# EasyEDA Pro project #第八届立创电赛#基于瑞萨单片机的电池内阻测试仪.eprj

# Schematic #第八届立创电赛#基于瑞萨单片机的电池内阻测试仪
Create Date: 2023-05-11; Page Name: #第八届立创电赛#基于瑞萨单片机的电池内阻测试仪; Project Name: #第八届立创电赛#基于瑞萨单片机的电池内阻测试仪; Schematic Name: #第八届立创电赛#基于瑞萨单片机的电池内阻测试仪; Update Date: 2023-09-26; Company: 嘉立创EDA; Page Size: A2; Version: V1.0
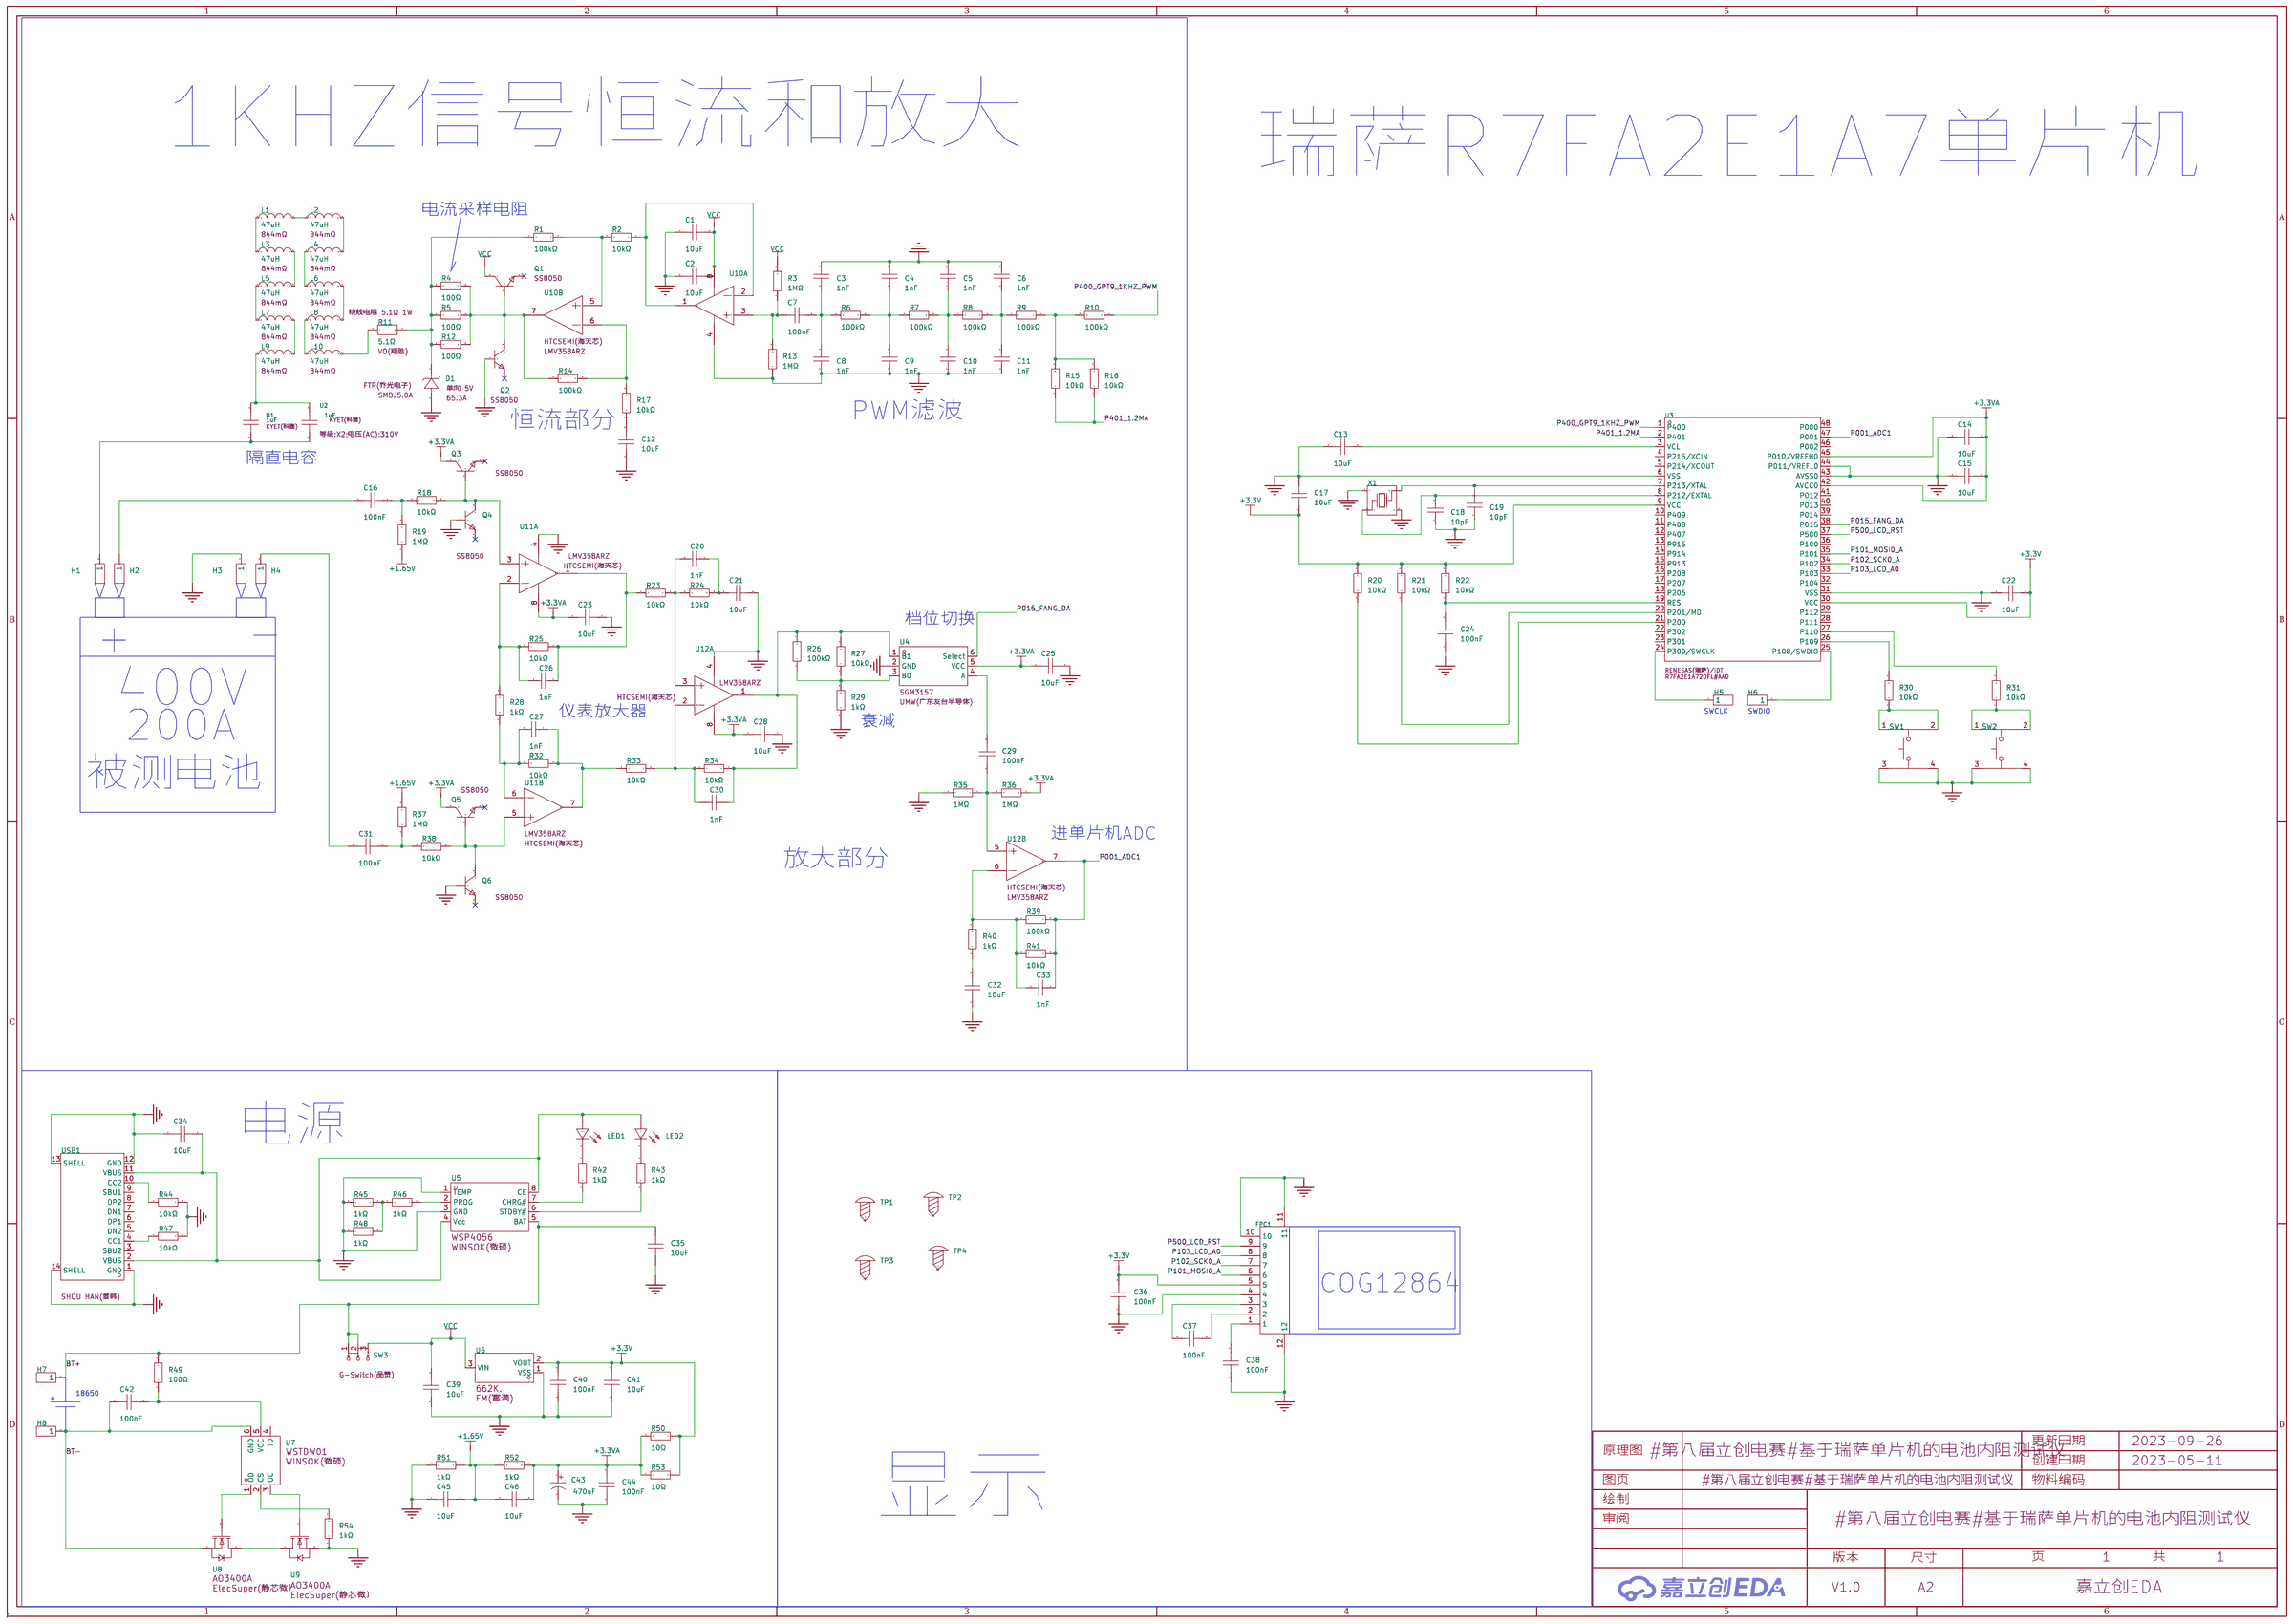
[diagram p0: schematic sheet]

## Parts
C1  10uF  [C0603]
C2  10uF  [C0603]
C3  1nF  [C0603]
C4  1nF  [C0603]
C5  1nF  [C0603]
C6  1nF  [C0603]
C7  100nF  [C0603]
C8  1nF  [C0603]
C9  1nF  [C0603]
C10  1nF  [C0603]
C11  1nF  [C0603]
C12  10uF  [C0603]
C13  10uF  [C0603]
C14  10uF  [C0603]
C15  10uF  [C0603]
C16  100nF  [CAP-TH_L13.0-W6.0-P10.00-D1.0]
C17  10uF  [C0603]
C18  10pF  [C0603]
C19  10pF  [C0603]
C20  1nF  [C0603]
C21  10uF  [C0603]
C22  10uF  [C0603]
C23  10uF  [C0603]
C24  100nF  [C0603]
C25  10uF  [C0603]
C26  1nF  [C0603]
C27  1nF  [C0603]
C28  10uF  [C0603]
C29  100nF  [C0603]
C30  1nF  [C0603]
C31  100nF  [CAP-TH_L13.0-W6.0-P10.00-D1.0]
C32  10uF  [C0603]
C33  1nF  [C0603]
C34  10uF  [C0603]
C35  10uF  [C0603]
C36  100nF  [C0603]
C37  100nF  [C0603]
C38  100nF  [C0603]
C39  10uF  [C0603]
C40  100nF  [C0603]
C41  10uF  [C0603]
C42  100nF  [C0603]
C43  470uF  [CAP-TH_BD8.0-P3.50-D0.6-FD]
C44  100nF  [C0603]
C45  10uF  [C0603]
C46  10uF  [C0603]
D1  SMBJ5.0A  [SMB_L4.3-W3.6-LS5.3-RD]
FPC1  AFA01-S10FCA-00  [FPC-SMD_10P-P1.0_FGS-XJ-H2.0]
H1  -  [HDR-TH_1P-V-M_XKB_X4611WV-01I-C28D40]
H2  -  [HDR-TH_1P-V-M_XKB_X4611WV-01I-C28D40]
H3  -  [HDR-TH_1P-V-M_XKB_X4611WV-01I-C28D40]
H4  -  [HDR-TH_1P-V-M_XKB_X4611WV-01I-C28D40]
H5  -  [HDR-TH_1P-V-M_XKB_X4611WV-01I-C28D40]
H6  -  [HDR-TH_1P-V-M_XKB_X4611WV-01I-C28D40]
H7  -  [HDR-TH_1P-V-M_XKB_X4611WV-01I-C28D40]
H8  -  [HDR-TH_1P-V-M_XKB_X4611WV-01I-C28D40]
L1  47uH  [IND-SMD_L4.5-W4.0_SLF0403]
L2  47uH  [IND-SMD_L4.5-W4.0_SLF0403]
L3  47uH  [IND-SMD_L4.5-W4.0_SLF0403]
L4  47uH  [IND-SMD_L4.5-W4.0_SLF0403]
L5  47uH  [IND-SMD_L4.5-W4.0_SLF0403]
L6  47uH  [IND-SMD_L4.5-W4.0_SLF0403]
L7  47uH  [IND-SMD_L4.5-W4.0_SLF0403]
L8  47uH  [IND-SMD_L4.5-W4.0_SLF0403]
L9  47uH  [IND-SMD_L4.5-W4.0_SLF0403]
L10  47uH  [IND-SMD_L4.5-W4.0_SLF0403]
LED1  204-10SURD/S530-A3-L  [LED-TH_BD3.0-P2.54-FD]
LED2  204-10SURD/S530-A3-L  [LED-TH_BD3.0-P2.54-FD]
Q1  SS8050  [SOT-23-3_L2.9-W1.3-P1.90-LS2.4-BR]
Q2  SS8050  [SOT-23-3_L2.9-W1.3-P1.90-LS2.4-BR]
Q3  SS8050  [SOT-23-3_L2.9-W1.3-P1.90-LS2.4-BR]
Q4  SS8050  [SOT-23-3_L2.9-W1.3-P1.90-LS2.4-BR]
Q5  SS8050  [SOT-23-3_L2.9-W1.3-P1.90-LS2.4-BR]
Q6  SS8050  [SOT-23-3_L2.9-W1.3-P1.90-LS2.4-BR]
R1  100kΩ  [R0603]
R2  10kΩ  [R0603]
R3  1MΩ  [R0603]
R4  100Ω  [R2512]
R5  100Ω  [R2512]
R6  100kΩ  [R0603]
R7  100kΩ  [R0603]
R8  100kΩ  [R0603]
R9  100kΩ  [R0603]
R10  100kΩ  [R0603]
R11  5.1Ω  [RES-TH_BD3.5-L9.0-P13.00-D0.8]
R12  100Ω  [R2512]
R13  1MΩ  [R0603]
R14  100kΩ  [R0603]
R15  10kΩ  [R0603]
R16  10kΩ  [R0603]
R17  10kΩ  [R0603]
R18  10kΩ  [R0603]
R19  1MΩ  [R0603]
R20  10kΩ  [R0603]
R21  10kΩ  [R0603]
R22  10kΩ  [R0603]
R23  10kΩ  [R0603]
R24  10kΩ  [R0603]
R25  10kΩ  [R0603]
R26  100kΩ  [R0603]
R27  10kΩ  [R0603]
R28  1kΩ  [R0603]
R29  1kΩ  [R0603]
R30  10kΩ  [R0603]
R31  10kΩ  [R0603]
R32  10kΩ  [R0603]
R33  10kΩ  [R0603]
R34  10kΩ  [R0603]
R35  1MΩ  [R0603]
R36  1MΩ  [R0603]
R37  1MΩ  [R0603]
R38  10kΩ  [R0603]
R39  100kΩ  [R0603]
R40  1kΩ  [R0603]
R41  10kΩ  [R0603]
R42  1kΩ  [R0603]
R43  1kΩ  [R0603]
R44  10kΩ  [R0603]
R45  1kΩ  [R0603]
R46  1kΩ  [R0603]
R47  10kΩ  [R0603]
R48  1kΩ  [R0603]
R49  100Ω  [R0603]
R50  10Ω  [R0603]
R51  1kΩ  [R0603]
R52  1kΩ  [R0603]
R53  10Ω  [R0603]
R54  1kΩ  [R0603]
SW1  1TS005A-2500-5001  [SW-TH_4P-L6.0-W6.0-P3.90-LS6.5]
SW2  1TS005A-2500-5001  [SW-TH_4P-L6.0-W6.0-P3.90-LS6.5]
SW3  SS-12F20-G070  [SW-TH_G-SWITCH_SS-12F20-G070]
TP1  -  [M2螺丝]
TP2  -  [M2螺丝]
TP3  -  [M2螺丝]
TP4  -  [M2螺丝]
U1  1uF  [CAP-TH_L18.0-W11.0-P15.00-D0.8]
U2  1uF  [CAP-TH_L18.0-W11.0-P15.00-D0.8]
U3  R7FA2E1A72DFL#AA0  [LQFP-48_L7.0-W7.0-P0.50-LS9.0-BL]
U4  SGM3157  [SC-70-6_L2.2-W1.3-P0.65-LS2.1-BL]
U5  WSP4056  [SOP-8_L5.1-W3.9-P1.27-LS6.0-BL]
U6  662K.  [SOT-23-3_L2.9-W1.3-P1.90-LS2.4-BR]
U7  WSTDW01  [SOT-23-6_L2.9-W1.6-P0.95-LS2.8-BR]
U8  AO3400A  [SOT-23-3_L3.0-W1.6-P1.90-LS2.8-BR]
U9  AO3400A  [SOT-23-3_L3.0-W1.6-P1.90-LS2.8-BR]
U10  LMV358ARZ  [SOP-8_L4.9-W3.9-P1.27-LS6.0-BL]  (sections 1,2)
U11  LMV358ARZ  [SOP-8_L4.9-W3.9-P1.27-LS6.0-BL]  (sections 1,2)
U12  LMV358ARZ  [SOP-8_L4.9-W3.9-P1.27-LS6.0-BL]  (sections 1,2)
USB1  TYPE-C 16PIN 2MD(073)  [USB-C-SMD_TYPE-C-6PIN-2MD-073]
X1  -  [OSC-SMD_4P-L3.2-W2.5-BL]

## Library data of the parts
C1 C2 C12-C15 C17 C21-C23 C25 C28 C32 C34 C35 C39 C41 C45 C46 = CL10A106KP8NNNC: 容值:10uF;精度:±10%;额定电压:10V;材质(温度系数):X5R;; LCSC Part Name: 10uF ±10% 10V; Supplier Part: C19702; Manufacturer: SAMSUNG(三星); Supplier Footprint: 0603; JLCPCB Part Class: Basic Part; Datasheet: https://atta.szlcsc.com/upload/public/pdf/source/20160103/1457707703378.pdf; Supplier: LCSC; Tolerance: ±10%; Voltage Rated: 10V; Temperature Coefficient: X5R
C3-C6 C8-C11 C20 C26 C27 C30 C33 = CC0603JRNPO9BN102: 容值:1nF;精度:±5%;额定电压:50V;材质(温度系数):NP0;; LCSC Part Name: 1nF ±5% 50V; Supplier Part: C106246; Manufacturer: YAGEO(国巨); Supplier Footprint: 0603; JLCPCB Part Class: Extended Part; Datasheet: https://atta.szlcsc.com/upload/public/pdf/source/20170505/1493957838062.pdf; Supplier: LCSC; Tolerance: ±5%; Voltage Rated: 50V; Temperature Coefficient: NP0
C7 C24 C29 C36-C38 C40 C42 C44 = CC0603KRX7R9BB104: 容值:100nF;精度:±10%;额定电压:50V;材质(温度系数):X7R;; LCSC Part Name: 100nF ±10% 50V; Supplier Part: C14663; Manufacturer: YAGEO(国巨); Supplier Footprint: 0603; JLCPCB Part Class: Basic Part; Datasheet: https://atta.szlcsc.com/upload/public/pdf/source/20180910/C282072_33301C7F631E79921B82A8DAC6BCC5B3.pdf; Supplier: LCSC; Tolerance: ±10%; Voltage Rated: 50V; Temperature Coefficient: X7R
C16 C31 = MP2104K27C3X6LC: 等级:X2;容值:100nF;精度:±10%;; LCSC Part Name: 等级:X2 100nF ±10%; Supplier Part: C105759; Manufacturer: SRD(圣融达); Supplier Footprint: 插件,P=10mm; JLCPCB Part Class: Extended Part; Datasheet: https://atta.szlcsc.com/upload/public/pdf/source/20211112/28AD7BCA5F9A6D19E46F5213448E69C0.pdf; Supplier: LCSC; Subclass: X2; Tolerance: ±10%
C18 C19 = CC0603JRNPO9BN100: 容值:10pF;精度:±5%;额定电压:50V;材质(温度系数):NP0;; LCSC Part Name: 10pF ±5% 50V; Supplier Part: C106245; Manufacturer: YAGEO(国巨); Supplier Footprint: 0603; JLCPCB Part Class: Extended Part; Datasheet: https://atta.szlcsc.com/upload/public/pdf/source/20170505/1493957837406.pdf; Supplier: LCSC; Tolerance: ±5%; Voltage Rated: 50V; Temperature Coefficient: NP0
C43 = KM477M016F12RR0VH2FP0: 容值:470uF;精度:±20%;额定电压:16V;; LCSC Part Name: 470uF ±20% 16V; Supplier Part: C28067; Manufacturer: CX(承兴); Supplier Footprint: 插件,D8xL12mm; JLCPCB Part Class: Extended Part; Datasheet: https://atta.szlcsc.com/upload/public/pdf/source/20211027/06D6BA3719C264B639DC286D935D03EA.pdf; Supplier: LCSC; Tolerance: ±20%; Rated Voltage: 16V; φD: 8mm; L: 12mm; Lead Spacing: 3.5mm; Lifetime @ Temp: 2000hrs@105℃
D1 = SMBJ5.0A_C693503: 极性:单向;反向截止电压(Vrwm):5V;击穿电压(最小值):6.4V;峰值脉冲电流(Ipp)@10/1000s:65.3A;最大钳位电压:9.2V;; LCSC Part Name: 单向 5V; Supplier Part: C693503; Manufacturer: FTR(乔光电子); Supplier Footprint: SMB(DO-214AA); JLCPCB Part Class: Extended Part; Datasheet: https://atta.szlcsc.com/upload/public/pdf/source/20200701/C693490_2A1922FF33BB98835C22E740F3EF18EC.pdf; Supplier: LCSC; Polarity: 单向; Reverse Stand-Off Voltage (Vrwm): 5V; Breakdown Voltage (Min): 6.4V; Peak Pulse Current (Ipp)@10/1000μs: 65.3A; Maximum Clamping Voltage: 9.2V
FPC1 = AFA01-S10FCA-00: 间距:1mm;触点数量:10;锁定特性:翻盖式;安装类型:卧贴;触点类型:下接;; LCSC Part Name: FPC 1.0MM 10P 翻盖式 H2.0mm 下接; Supplier Part: C262756; Manufacturer: JS(钜硕电子); Supplier Footprint: P=1mm; JLCPCB Part Class: Extended Part; Supplier: LCSC; Pitch: 1mm; Number of Contacts: 10; Locking Feature: 翻盖式; Mounting Type: 卧贴; Contact Type: 下接; Height Above Board: 2mm; FFC, FCB Thickness: 0.3mm~0.3mm
H1-H8 = HDR-M_2.54_1x1P: Supplier Part: C81276; Supplier Footprint: 插件; JLCPCB Part Class: Extended Part
L1-L10 = SLF0403-470KTT: 电感值:47uH;精度:±10%;额定电流:540mA;; LCSC Part Name: 47uH ±10% 540mA 844mΩ; Supplier Part: C182152; Manufacturer: Sunltech(韩国顺磁); Supplier Footprint: SMD; JLCPCB Part Class: Extended Part; Datasheet: https://atta.szlcsc.com/upload/public/pdf/source/20180622/C182152_7E479EAE8C34B9E34441182146F93730.pdf; Supplier: LCSC; Tolerance: ±10%; Rated Current: 540mA; DC Resistance (DCR): 844mΩ
LED1 LED2 = 204-10SURD/S530-A3-L: 发光颜色:红灯;二极管配置:-;主波长:624nm;色温:-;功率:60mW;安装方式:-;; LCSC Part Name: 红灯; Supplier Part: C99771; Manufacturer: EVERLIGHT(亿光); Supplier Footprint: 插件,D=3mm; JLCPCB Part Class: Extended Part; Datasheet: https://atta.szlcsc.com/upload/public/pdf/source/20170504/1493866972127.pdf; Supplier: LCSC; Emitted Color: 红灯; Lens Color: 雾状红; Dominant Wavelength: 624nm; Peak Wavelength: 632nm; Forward Current: 20mA; Power Dissipation: 60mW; Viewing Angle: 40°; Operating Temperature: -40℃~+85℃; Lamp Holder Type: 3mm圆形灯头
Q1-Q6 = SS8050_C5249676: Polarity NPN 耗散功率(W) 0.3 最大集电极电流(mA) 1500 集电极-基极电压（V） 40 饱和压降（V） 0.5 集电极/基极电流（mA） 800/80 最大工作频率(MHz) 100; Supplier Part: C5249676; Manufacturer: ElecSuper(静芯微）; Supplier Footprint: SOT-23; JLCPCB Part Class: Extended Part; Datasheet: https://atta.szlcsc.com/upload/public/pdf/source/20221109/25143ABAE3EF3AA2633DA047E92DED74.pdf; Supplier: LCSC
R1 R6-R10 R14 R26 R39 = RC0603FR-07100KL: 电阻类型:厚膜电阻;阻值:100kΩ;精度:±1%;功率:100mW;; LCSC Part Name: 100kΩ ±1% 100mW; Supplier Part: C14675; Manufacturer: YAGEO(国巨); Supplier Footprint: 0603; JLCPCB Part Class: Extended Part; Datasheet: https://atta.szlcsc.com/upload/public/pdf/source/20140324/1457707028752.pdf; Supplier: LCSC; Type: 厚膜电阻; Tolerance: ±1%; Power(Watts): 100mW; Temperature Coefficient: ±100ppm/℃; Overload Voltage (Max): 75V; Operating Temperature Range: -55℃~+155℃
R2 R15-R18 R20-R25 R27 R30-R34 R38 R41 R44 R47 = RC0603FR-0710KL: 电阻类型:厚膜电阻;阻值:10kΩ;精度:±1%;功率:100mW;; LCSC Part Name: 10kΩ ±1% 100mW; Supplier Part: C98220; Manufacturer: YAGEO(国巨); Supplier Footprint: 0603; JLCPCB Part Class: Extended Part; Datasheet: https://atta.szlcsc.com/upload/public/pdf/source/20170522/1495423494387.pdf; Supplier: LCSC; Type: 厚膜电阻; Tolerance: ±1%; Power(Watts): 100mW; Temperature Coefficient: ±100ppm/℃; Overload Voltage (Max): 75V; Operating Temperature Range: -55℃~+155℃
R3 R13 R19 R35-R37 = 0603WAF1004T5E: 电阻类型:厚膜电阻;阻值:1MΩ;精度:±1%;功率:100mW;; LCSC Part Name: 1MΩ ±1% 100mW; Supplier Part: C22935; Manufacturer: UNI-ROYAL(厚声); Supplier Footprint: 0603; JLCPCB Part Class: Basic Part; Datasheet: https://atta.szlcsc.com/upload/public/pdf/source/20200306/C422600_1E6D84923E4A46A82E41ADD87F860B5C.pdf; Supplier: LCSC; Type: 厚膜电阻; Tolerance: ±1%; Power(Watts): 100mW; Temperature Coefficient: ±100ppm/℃; Overload Voltage (Max): 75V; Operating Temperature Range: -55℃~+155℃
R4 R5 R12 = CRH2512J100RE04Z: 电阻类型:厚膜电阻;阻值:100Ω;精度:±5%;功率:2W;; LCSC Part Name: 100Ω ±5% 2W; Supplier Part: C175441; Manufacturer: EVER OHMS(天二科技); Supplier Footprint: 2512; JLCPCB Part Class: Extended Part; Datasheet: https://atta.szlcsc.com/upload/public/pdf/source/20190415/C175441_84808E9EE7421A14EC56ED3F852BAD33.pdf; Supplier: LCSC; Type: 厚膜电阻; Tolerance: ±5%; Power(Watts): 2W; Temperature Coefficient: ±100ppm/℃; Overload Voltage (Max): 200V; Operating Temperature Range: -55℃~+155℃
R11 = KNP1WS-5Ω1±5%-2T52: 电阻类型:绕线电阻;阻值:5.1Ω;精度:±5%;功率:1W;温度系数:±350ppm/℃;; LCSC Part Name: 绕线电阻 5.1Ω 1W; Supplier Part: C601740; Manufacturer: VO(翔胜); Supplier Footprint: 插件; JLCPCB Part Class: Extended Part; Datasheet: https://atta.szlcsc.com/upload/public/pdf/source/20200609/C601736_823D5FEC32C33ED68EDB1181C52D1F38.pdf; Supplier: LCSC; Type: 绕线电阻; Tolerance: ±5%; Power(Watts): 1W; Temperature Coefficient: ±350ppm/℃
R28 R29 R40 R42 R43 R45 R46 R48 R51 R52 R54 = RC0603FR-071KL: 电阻类型:厚膜电阻;阻值:1kΩ;精度:±1%;功率:100mW;; LCSC Part Name: 1kΩ ±1% 100mW; Supplier Part: C22548; Manufacturer: YAGEO(国巨); Supplier Footprint: 0603; JLCPCB Part Class: Extended Part; Datasheet: https://atta.szlcsc.com/upload/public/pdf/source/20180312/7BD3618A8B6324EA6280B0497A051AB7.pdf; Supplier: LCSC; Type: 厚膜电阻; Tolerance: ±1%; Power(Watts): 100mW; Temperature Coefficient: ±100ppm/℃; Overload Voltage (Max): 75V; Operating Temperature Range: -55℃~+155℃
R49 = RC0603FR-07100RL: 电阻类型:厚膜电阻;阻值:100Ω;精度:±1%;功率:100mW;; LCSC Part Name: 100Ω ±1% 100mW; Supplier Part: C105588; Manufacturer: YAGEO(国巨); Supplier Footprint: 0603; JLCPCB Part Class: Extended Part; Datasheet: https://atta.szlcsc.com/upload/public/pdf/source/20170428/1493376742308.pdf; Supplier: LCSC; Type: 厚膜电阻; Tolerance: ±1%; Power(Watts): 100mW; Temperature Coefficient: ±100ppm/℃; Overload Voltage (Max): 75V; Operating Temperature Range: -55℃~+155℃
R50 R53 = 0603WAF100JT5E: 电阻类型:厚膜电阻;阻值:10Ω;精度:±1%;功率:100mW;; LCSC Part Name: 10Ω ±1% 100mW; Supplier Part: C22859; Manufacturer: UNI-ROYAL(厚声); Supplier Footprint: 0603; JLCPCB Part Class: Basic Part; Datasheet: https://atta.szlcsc.com/upload/public/pdf/source/20200306/C422600_1E6D84923E4A46A82E41ADD87F860B5C.pdf; Supplier: LCSC; Type: 厚膜电阻; Tolerance: ±1%; Power(Watts): 100mW; Temperature Coefficient: ±400ppm/℃; Overload Voltage (Max): 75V; Operating Temperature Range: -55℃~+155℃
SW1 SW2 = 1TS005A-2500-5001: 触点电流:50mA;额定电压(DC):12V;额定功率:0.6W;绝缘电阻:100MΩ;电路结构:单刀单掷;安装方式:直插;带灯:无;作用力:250gf@±50gf;机械寿命:7万次;带支架:否;; LCSC Part Name: 6*6*5mm 直插 轻触开关; Supplier Part: C255811; Manufacturer: HYP(鸿源精密); Supplier Footprint: 插件,6x6mm; JLCPCB Part Class: Extended Part; Datasheet: https://atta.szlcsc.com/upload/public/pdf/source/20180720/C255811_DA12C4E3C20854D48E888AEA64926F5F.pdf; Supplier: LCSC; Contact Current: 50mA; Voltage Rating (DC): 12V; Power Rating: 0.6W; Insulation Resistance: 100MΩ; Circuit: 单刀单掷; Mounting Style: 直插; Actuator Style: 圆形按钮; Actuator/Cap Color: 黑色; With Lamp: 无; Operating Force: 250gf@±50gf; Mechanical Life: 7万次; Operating Temperature: -40℃~+90℃; Pin Style: PC引脚; Switch Length: 6mm; Switch Width: 6mm; Switch Height: 5mm; Strike Gundam: 否
SW3 = SS-12F20-G070: 额定电流(DC):500mA;额定电压(DC):250V;电路结构:单刀双掷;安装方式:直插;机械寿命:-;开关颜色:黑色;; LCSC Part Name: 柄长7mm 直插两档 滑动开关; Supplier Part: C2848914; Manufacturer: G-Switch(品赞); Supplier Footprint: 插件; JLCPCB Part Class: Extended Part; Datasheet: https://atta.szlcsc.com/upload/public/pdf/source/20210825/E0137178672C137814869A76188F885C.pdf; Supplier: LCSC; Current Rating (DC): 500mA; Voltage Rating (DC): 250V; Circuit: 单刀双掷; Mounting Style: 直插; Actuator Color: 黑色; Actuator Style: 矩形柱状; Pin Style: PC引脚; Switch Length: 11.5mm; Switch Width: 5.8mm; Switch Height: 12mm
TP1-TP4 = M2螺丝: Supplier Footprint: 插件
U1 = PX105K2C1503: 等级:X2;容值:1uF;精度:±10%;电压(AC):310V；380V；350V;; LCSC Part Name: 等级:X2 1uF ±10% 310V 350V 380V; Supplier Part: C2693799; Manufacturer: KYET(科雅); Supplier Footprint: 插件,P=15mm; JLCPCB Part Class: Extended Part; Datasheet: https://atta.szlcsc.com/upload/public/pdf/source/20210316/C2693799_1D9D08CA009E86014ECDE6A066F5174D.pdf; Supplier: LCSC; Subclass: X2; Tolerance: ±10%; Voltage(AC): 310V；380V；350V; Operating Temperature: -40℃~+110℃
U2 = PX105K2C1503: 等级:X2;电压(AC):310V; LCSC Part Name: 等级:X2 1uF ±10% 310V 350V 380V; Supplier Part: C2693799; Manufacturer: KYET(科雅); Supplier Footprint: 插件,P=15mm; JLCPCB Part Class: Extended Part; Datasheet: https://atta.szlcsc.com/upload/public/pdf/source/20210316/C2693799_1D9D08CA009E86014ECDE6A066F5174D.pdf; Supplier: LCSC; Subclass: X2; Tolerance: ±10%; Voltage(AC): 310V；380V；350V; Operating Temperature: -40℃~+110℃
U3 = R7FA2E1A72DFL#AA0: CPU内核:ARM Cortex-M23;CPU最大主频:48MHz;工作电压范围:1.6V~5.5V;程序存储容量:64KB;RAM总容量:16KB;GPIO端口数量:40;; Supplier Part: C2932201; Manufacturer: RENESAS(瑞萨)/IDT; Supplier Footprint: LQFP-48(7x7); JLCPCB Part Class: Extended Part; Datasheet: https://atta.szlcsc.com/upload/public/pdf/source/20211215/29BE301818A18D7F99D1A8CE53F7A919.pdf; Supplier: LCSC; CPU Core: ARM Cortex-M23; CPU Maximum Speed: 48MHz; Operating Voltage Range: 1.6V~5.5V; Program Storage Size: 64KB; RAM Size: 16KB; EEPROM: 4KB; GPIO Ports Number: 40; ADC (Bit): 12bit; Peripheral/Function: 触摸按键；安全加密; communication protocol: 以太网协议; Watchdog: 有; Real-Time Clock: 有; Low-Voltage Detect: 有; Direct Memory Access: 有; Operating Temperature Range: -40℃~+85℃
U4 = SGM3157: 开关电路:-;; LCSC Part Name: 二选一模拟开关电路; Supplier Part: C394901; Manufacturer: UMW(广东友台半导体); Supplier Footprint: SC-70-6; JLCPCB Part Class: Extended Part; Datasheet: https://atta.szlcsc.com/upload/public/pdf/source/20220825/163C0318ED3C3969CBD04552300499AD.pdf; Supplier: LCSC
U5 = WSP4056: Supplier Part: C2985892; Manufacturer: WINSOK(微硕); Supplier Footprint: SOP-8; JLCPCB Part Class: Extended Part; Supplier: LCSC
U6 = 662K.: 输出类型:-;; LCSC Part Name: 662K; Supplier Part: C841298; Manufacturer: FM(富满); Supplier Footprint: SOT23-3; JLCPCB Part Class: Extended Part; Datasheet: https://atta.szlcsc.com/upload/public/pdf/watermark/20200922/C841298_3E220732626B158CD6AC195AF78C7FB8.pdf; Supplier: LCSC
U7 = WSTDW01: 充电电池的类型:-;电池单元组数:-;最大充电电流:-;充满的电池组电压:-;最大供应电压:-;; Supplier Part: C86873; Manufacturer: WINSOK(微硕); Supplier Footprint: SOT-23-6; JLCPCB Part Class: Extended Part; Datasheet: https://atta.szlcsc.com/upload/public/pdf/source/20161110/1478743415995.pdf; Supplier: LCSC
U8 U9 = AO3400A_C5224194: 类型:N沟道;漏源电压(Vdss):30V;连续漏极电流(Id):6A;功率(Pd):1.4W;导通电阻(RDS(on)@Vgs,Id):19mΩ@10V,6.0A;; LCSC Part Name: N沟道 30V 6A; Supplier Part: C5224194; Manufacturer: ElecSuper(静芯微）; Supplier Footprint: SOT-23-3L; JLCPCB Part Class: Extended Part; Datasheet: https://atta.szlcsc.com/upload/public/pdf/source/20221027/D95D9171DDBB7BB324532F3AF1EADB7E.pdf; Supplier: LCSC; Type: N沟道; Drain Source Voltage (Vdss): 30V; Continuous Drain Current (Id): 6A; Power Dissipation (Pd): 1.4W; Drain Source On Resistance (RDS(on)@Vgs,Id): 19mΩ@10V,6.0A; Gate Threshold Voltage (Vgs(th)@Id): 1V@250uA
U10-U12 = LMV358ARZ: CMOS低功耗双路运算放大器; Supplier Part: C2928823; Manufacturer: HTCSEMI(海天芯); Supplier Footprint: SOP-8; JLCPCB Part Class: Extended Part; Datasheet: https://atta.szlcsc.com/upload/public/pdf/source/20220114/2D4B849A76DE33264688A93B3A90A0F8.pdf; Supplier: LCSC
USB1 = TYPE-C 16PIN 2MD(073): 连接器类型:Type-C;标准:-;公母:母座;触点数量:16;端口数量:1;安装方式:卧贴;额定电流 - 电源:5A;工作温度范围:-25℃~+85℃;; LCSC Part Name: TYPE-C母座 16P 4脚插件带定位柱 不锈钢外壳 2次模顶; Supplier Part: C2765186; Manufacturer: SHOU HAN(首韩); Supplier Footprint: SMD; JLCPCB Part Class: Extended Part; Datasheet: https://atta.szlcsc.com/upload/public/pdf/source/20211123/39B17C16241EAC15C5E277BDA434118E.pdf; Supplier: LCSC; Connector Type: Type-C; Gender: 母座; Number of Contacts: 16; Number of Ports: 1; Mounting Style: 卧贴; Current Rating - Power (Max): 5A; Operating Temperature Range: -25℃~+85℃
X1 = 7325-3200A0910-00: 频率:-;负载电容:-;; LCSC Part Name: 贴片晶振/4脚贴片晶振 3225 32.000M9PF±10PPM; Supplier Part: C389917; Manufacturer: XTY(新天源); Supplier Footprint: SMD3225-4P; JLCPCB Part Class: Extended Part; Datasheet: https://atta.szlcsc.com/upload/public/pdf/source/20190701/C389917_3C14DEC715AEA10707B995A6A67E06D3.pdf; Supplier: LCSC

## Nets
+1.65V: C45.2 C46.1 R19.1 R37.2 R51.1 R52.2
+3.3V: C17.1 C22.2 C36.2 C40.2 C41.2 FPC1.5 R20.2 R21.2 R22.2 R50.2 R53.2 U3.9(VCC) U3.30(VCC) U6.2(VOUT)
+3.3VA: C14.1 C15.2 C23.1 C25.1 C28.1 C43.1 C44.2 C46.2 Q3.3(C) Q5.3(C) R36.1 R50.1 R52.1 R53.1 U3.42(AVCC0) U3.45(P010/VREFH0) U4.5(VCC) U11.8(VCC) U12.8(VCC)
GND: C1.1 C2.1 C3.2 C4.2 C5.2 C6.2 C8.1 C9.1 C10.1 C11.1 C12.1 C13.1 C14.2 C15.1 C17.2 C18.1 C19.1 C21.2 C22.1 C23.2 C24.1 C25.2 C28.2 C32.1 C34.1 C35.1 C36.1 C38.1 C39.1 C40.1 C41.1 C43.2 C44.1 C45.1 D1.2(A) FPC1.4 FPC1.10 FPC1.11 FPC1.12 H3.1 Q2.1(B) Q4.1(B) Q6.1(B) R13.1 R29.1 R35.2 R44.2 R45.2 R47.2 R48.2 R51.2 R54.1 SW1.3 SW1.4 SW2.3 SW2.4 U3.6(VSS) U3.31(VSS) U3.43(AVSS0) U3.44(P011/VREFL0) U4.2(GND) U5.1(TEMP) U5.3(GND) U6.1(VSS) U9.2(S) U10.4(GND) U11.4(GND) U12.4(GND) USB1.1(GND) USB1.12(GND) USB1.13(SHELL) USB1.14(SHELL) X1.2 X1.4
VCC: C1.2 C2.2 C39.2 Q1.3(C) R3.2 SW3.3 U6.3(VIN) U10.8(VCC)
BT+: C35.2 H7.1 R49.2 SW3.1 SW3.2 U5.5(BAT)
BT-: C42.1 H8.1 U7.6(GND) U8.2(S)
P001_ADC1: C33.1 R39.2 R41.2 U3.47(P001) U12.7(OUT2)
P015_FANG_DA: U3.38(P015) U4.6(Select)
P101_MOSI0_A: FPC1.6 U3.35(P101)
P102_SCK0_A: FPC1.7 U3.34(P102)
P103_LCD_A0: FPC1.8 U3.33(P103)
P400_GPT9_1KHZ_PWM: R10.2 U3.1(P400)
P401_1.2MA: R15.1 R16.1 U3.2(P401)
P500_LCD_RST: FPC1.9 U3.37(P500)
Net-(C3-1): C3.1 C7.2 C8.2 R6.1
Net-(C4-1): C4.1 C9.2 R6.2 R7.1
Net-(C5-1): C5.1 C10.2 R7.2 R8.1
Net-(C6-1): C6.1 C11.2 R8.2 R9.1
Net-(C7-1): C7.1 R3.1 R13.2 U10.3(IN1+)
Net-(C12-2): C12.2 R17.1
Net-(C13-2): C13.2 U3.3(VCL)
Net-(C16-1): C16.1 R18.1 R19.2
Net-(C16-2): C16.2 H2.1
Net-(C18-2): C18.2 U3.8(P212/EXTAL) X1.1
Net-(C19-2): C19.2 U3.7(P213/XTAL) X1.3
Net-(C20-1): C20.1 C21.1 R24.2
Net-(C20-2): C20.2 R23.2 R24.1 U12.3(IN1+)
Net-(C24-2): C24.2 R22.1 U3.19(RES)
Net-(C26-1): C26.1 R23.1 R25.2 U11.1(OUT)
Net-(C26-2): C26.2 R25.1 R28.2 U11.2(IN1-)
Net-(C27-1): C27.1 R32.2 R33.1 U11.7(OUT2)
Net-(C27-2): C27.2 R28.1 R32.1 U11.6(IN2-)
Net-(C29-1): C29.1 R35.1 R36.2 U12.5(IN2+)
Net-(C29-2): C29.2 U4.4(A)
Net-(C30-1): C30.1 R26.2 R27.2 R34.2 U4.1(B1) U12.1(OUT)
Net-(C30-2): C30.2 R33.2 R34.1 U12.2(IN1-)
Net-(C31-1): C31.1 R37.1 R38.1
Net-(C31-2): C31.2 H4.1
Net-(C32-2): C32.2 R40.1
Net-(C33-2): C33.2 R39.1 R40.2 R41.1 U12.6(IN2-)
Net-(C34-2): C34.2 LED1.1(A) LED2.1(A) U5.4(Vcc) U5.8(CE) USB1.2(VBUS) USB1.11(VBUS)
Net-(C37-1): C37.1 FPC1.3
Net-(C37-2): C37.2 FPC1.2
Net-(C38-2): C38.2 FPC1.1
Net-(C42-2): C42.2 R49.1 U7.5(VCC)
Net-(D1-1): D1.1(C) R1.1 R4.1 R5.1 R11.2 R12.1
Net-(H1-1): H1.1 U1.1 U2.1
Net-(H5-1): H5.1 U3.24(P300/SWCLK)
Net-(H6-1): H6.1 U3.25(P108/SWDIO)
Net-(L1-1): L1.1 L3.1
Net-(L1-2): L1.2 L2.1
Net-(L2-2): L2.2 L4.2
Net-(L3-2): L3.2 L5.2
Net-(L4-1): L4.1 L6.1
Net-(L5-1): L5.1 L7.1
Net-(L6-2): L6.2 L8.2
Net-(L7-2): L7.2 L9.2
Net-(L8-1): L8.1 L10.1
Net-(L9-1): L9.1 U1.2 U2.2
Net-(L10-2): L10.2 R11.1
Net-(LED1-2): LED1.2(K) R42.2
Net-(LED2-2): LED2.2(K) R43.2
Net-(Q1-1): Q1.1(B) Q2.3(C) R4.2 R5.2 R12.2 R14.1 U10.7(OUT2)
Net-(Q3-1): Q3.1(B) Q4.3(C) R18.2 U11.3(IN1+)
Net-(Q5-1): Q5.1(B) Q6.3(C) R38.2 U11.5(IN2+)
Net-(R1-2): R1.2 R2.2 U10.5(IN2+)
Net-(R2-1): R2.1 U10.1(OUT) U10.2(IN1-)
Net-(R9-2): R9.2 R10.1 R15.2 R16.2
Net-(R14-2): R14.2 R17.2 U10.6(IN2-)
Net-(R20-1): R20.1 U3.21(P200)
Net-(R21-1): R21.1 U3.20(P201/MD)
Net-(R26-1): R26.1 R27.1 R29.2 U4.3(B0)
Net-(R30-1): R30.1 SW1.1 SW1.2
Net-(R30-2): R30.2 U3.26(P109)
Net-(R31-1): R31.1 SW2.1 SW2.2
Net-(R31-2): R31.2 U3.27(P110)
Net-(R42-1): R42.1 U5.7(CHRG#)
Net-(R43-1): R43.1 U5.6(STDBY#)
Net-(R44-1): R44.1 USB1.10(CC2)
Net-(R45-1): R45.1 R46.2 R48.1
Net-(R46-1): R46.1 U5.2(PROG)
Net-(R47-1): R47.1 USB1.4(CC1)
Net-(R54-2): R54.2 U7.2(CS)
Net-(U7-1): U7.1(OD) U8.1(G)
Net-(U7-3): U7.3(OC) U9.1(G)
Net-(U8-3): U8.3(D) U9.3(D)

Not connected (* = marked no-connect by the designer): Q1 2(E)*; Q2 2(E)*; Q3 2(E)*; Q4 2(E)*; Q5 2(E)*; Q6 2(E)*; TP1 1; TP2 1; TP3 1; TP4 1; U3 4(P215/XCIN) 5(P214/XCOUT) 10(P409) 11(P408) 12(P407) 13(P915) 14(P914) 15(P913) 16(P208) 17(P207) 18(P206) 22(P302) 23(P301) 28(P111) 29(P112) 32(P104) 36(P100) 39(P014) 40(P013) 41(P012) 46(P002) 48(P000); U7 4(TD); USB1 3(SBU2) 5(DN2) 6(DP1) 7(DN1) 8(DP2) 9(SBU1)

## Notes on the sheet
- 1KHZ信号恒流和放大
- 瑞萨R7FA2E1A7单片机
- 电流采样电阻
- PWM滤波
- 恒流部分
- 隔直电容
- 档位切换
- -
- +
- 400V
- 仪表放大器
- SWCLK
- SWDIO
- 衰减
- 200A
- 被测电池
- 进单片机ADC
- 放大部分
- 电源
- COG12864
- +
- 18650
- 显示
